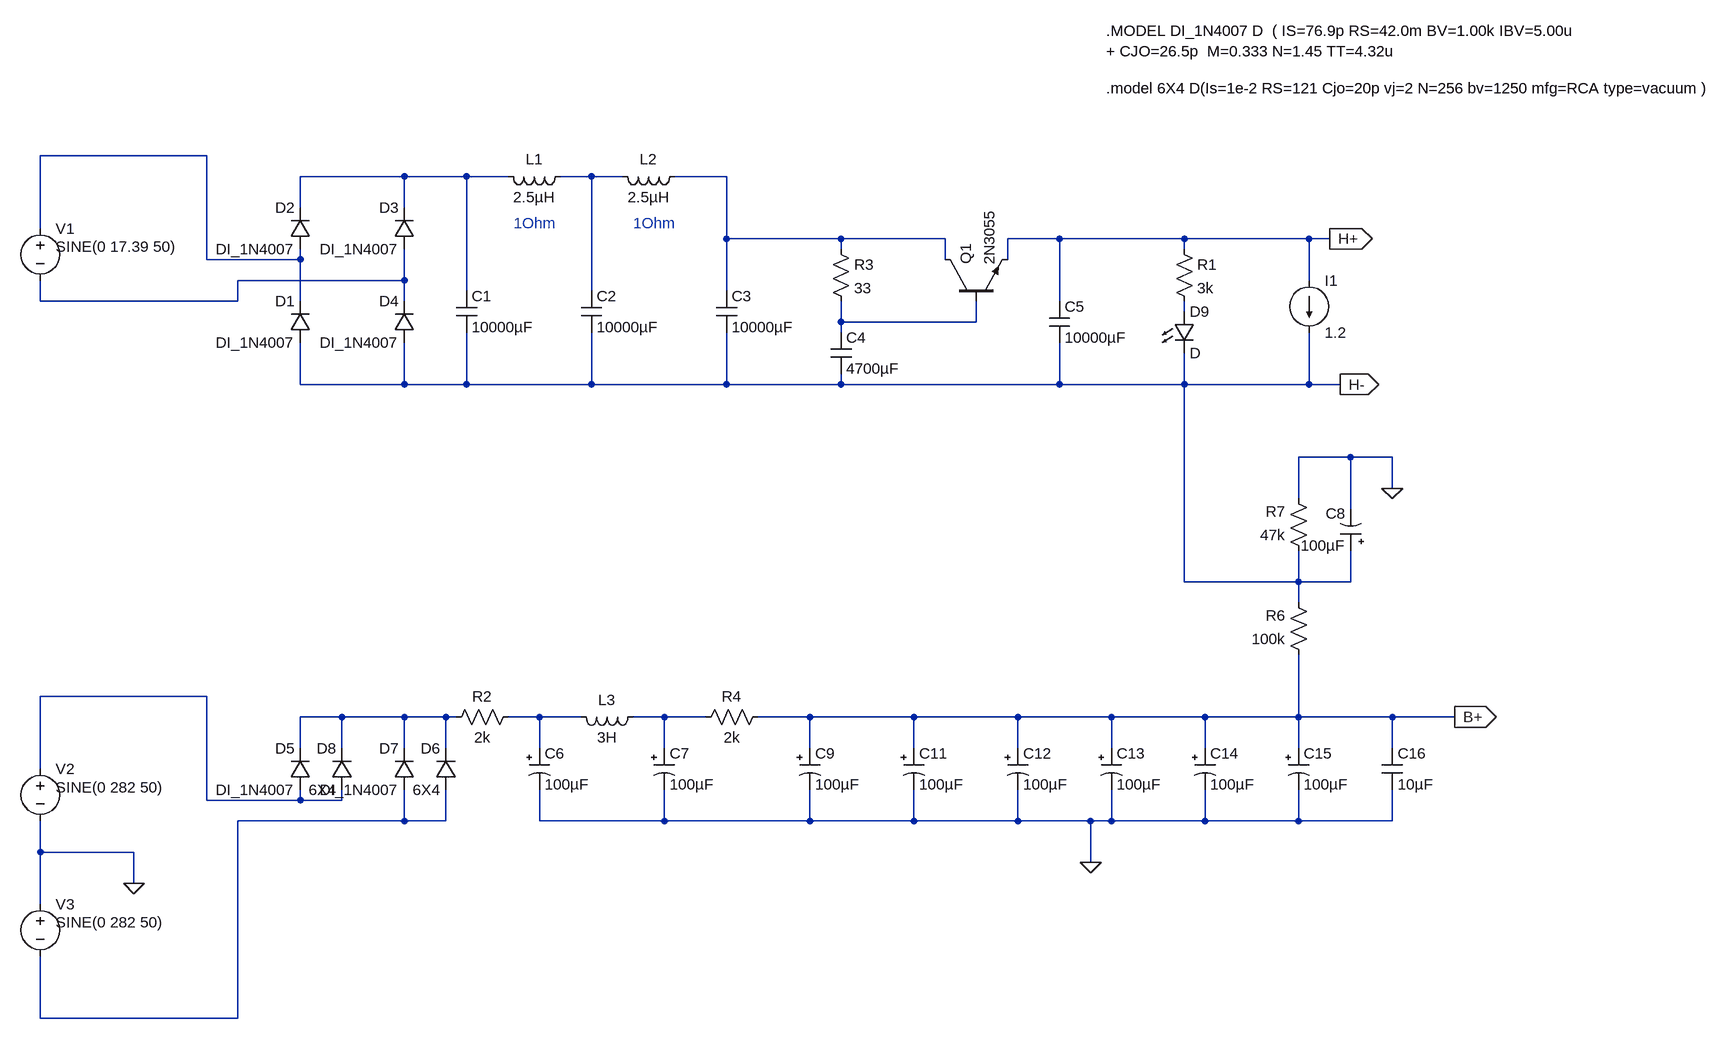
[diagram p0: schematic m77-psu-only.asc]
m77-psu-only.asc, the LTspice schematic file:
Version 4
SHEET 1 2672 1044
WIRE -4304 -5552 -4560 -5552
WIRE -4000 -5520 -4160 -5520
WIRE -3904 -5520 -4000 -5520
WIRE -3840 -5520 -3904 -5520
WIRE -3712 -5520 -3760 -5520
WIRE -3664 -5520 -3712 -5520
WIRE -3504 -5520 -3584 -5520
WIRE -4160 -5472 -4160 -5520
WIRE -4000 -5472 -4000 -5520
WIRE -4560 -5440 -4560 -5552
WIRE -3504 -5424 -3504 -5520
WIRE -3328 -5424 -3504 -5424
WIRE -3168 -5424 -3328 -5424
WIRE -2992 -5424 -3072 -5424
WIRE -2800 -5424 -2992 -5424
WIRE -2608 -5424 -2800 -5424
WIRE -2576 -5424 -2608 -5424
WIRE -3328 -5408 -3328 -5424
WIRE -2800 -5408 -2800 -5424
WIRE -4304 -5392 -4304 -5552
WIRE -4160 -5392 -4160 -5408
WIRE -4160 -5392 -4304 -5392
WIRE -3168 -5392 -3168 -5424
WIRE -3072 -5392 -3072 -5424
WIRE -4000 -5360 -4000 -5408
WIRE -4000 -5360 -4256 -5360
WIRE -2608 -5360 -2608 -5424
WIRE -3904 -5344 -3904 -5520
WIRE -3712 -5344 -3712 -5520
WIRE -3504 -5344 -3504 -5424
WIRE -4560 -5328 -4560 -5360
WIRE -4256 -5328 -4256 -5360
WIRE -4256 -5328 -4560 -5328
WIRE -4160 -5328 -4160 -5392
WIRE -4000 -5328 -4000 -5360
WIRE -2992 -5328 -2992 -5424
WIRE -2800 -5312 -2800 -5328
WIRE -3328 -5296 -3328 -5328
WIRE -3120 -5296 -3120 -5328
WIRE -3120 -5296 -3328 -5296
WIRE -3328 -5280 -3328 -5296
WIRE -4160 -5200 -4160 -5264
WIRE -4000 -5200 -4000 -5264
WIRE -4000 -5200 -4160 -5200
WIRE -3904 -5200 -3904 -5280
WIRE -3904 -5200 -4000 -5200
WIRE -3712 -5200 -3712 -5280
WIRE -3712 -5200 -3904 -5200
WIRE -3504 -5200 -3504 -5280
WIRE -3504 -5200 -3712 -5200
WIRE -3328 -5200 -3328 -5216
WIRE -3328 -5200 -3504 -5200
WIRE -2992 -5200 -2992 -5264
WIRE -2992 -5200 -3328 -5200
WIRE -2800 -5200 -2800 -5248
WIRE -2800 -5200 -2992 -5200
WIRE -2608 -5200 -2608 -5280
WIRE -2608 -5200 -2800 -5200
WIRE -2560 -5200 -2608 -5200
WIRE -2544 -5088 -2624 -5088
WIRE -2480 -5088 -2544 -5088
WIRE -2480 -5040 -2480 -5088
WIRE -2624 -5024 -2624 -5088
WIRE -2544 -5008 -2544 -5088
WIRE -2800 -4896 -2800 -5200
WIRE -2624 -4896 -2624 -4944
WIRE -2624 -4896 -2800 -4896
WIRE -2544 -4896 -2544 -4944
WIRE -2544 -4896 -2624 -4896
WIRE -2624 -4864 -2624 -4896
WIRE -4304 -4720 -4560 -4720
WIRE -4096 -4688 -4160 -4688
WIRE -4000 -4688 -4096 -4688
WIRE -3936 -4688 -4000 -4688
WIRE -3920 -4688 -3936 -4688
WIRE -3792 -4688 -3840 -4688
WIRE -3728 -4688 -3792 -4688
WIRE -3600 -4688 -3648 -4688
WIRE -3536 -4688 -3600 -4688
WIRE -3376 -4688 -3456 -4688
WIRE -3216 -4688 -3376 -4688
WIRE -3056 -4688 -3216 -4688
WIRE -2912 -4688 -3056 -4688
WIRE -2768 -4688 -2912 -4688
WIRE -2624 -4688 -2624 -4784
WIRE -2624 -4688 -2768 -4688
WIRE -2480 -4688 -2624 -4688
WIRE -2384 -4688 -2480 -4688
WIRE -4160 -4640 -4160 -4688
WIRE -4096 -4640 -4096 -4688
WIRE -4000 -4640 -4000 -4688
WIRE -3936 -4640 -3936 -4688
WIRE -3792 -4640 -3792 -4688
WIRE -3600 -4640 -3600 -4688
WIRE -3376 -4640 -3376 -4688
WIRE -3216 -4640 -3216 -4688
WIRE -3056 -4640 -3056 -4688
WIRE -2912 -4640 -2912 -4688
WIRE -2768 -4640 -2768 -4688
WIRE -2624 -4640 -2624 -4688
WIRE -2480 -4640 -2480 -4688
WIRE -4560 -4608 -4560 -4720
WIRE -4304 -4560 -4304 -4720
WIRE -4160 -4560 -4160 -4576
WIRE -4160 -4560 -4304 -4560
WIRE -4096 -4560 -4096 -4576
WIRE -4096 -4560 -4160 -4560
WIRE -4000 -4528 -4000 -4576
WIRE -4000 -4528 -4256 -4528
WIRE -3936 -4528 -3936 -4576
WIRE -3936 -4528 -4000 -4528
WIRE -3792 -4528 -3792 -4576
WIRE -3600 -4528 -3600 -4576
WIRE -3600 -4528 -3792 -4528
WIRE -3376 -4528 -3376 -4576
WIRE -3376 -4528 -3600 -4528
WIRE -3216 -4528 -3216 -4576
WIRE -3216 -4528 -3376 -4528
WIRE -3056 -4528 -3056 -4576
WIRE -3056 -4528 -3216 -4528
WIRE -2944 -4528 -3056 -4528
WIRE -2912 -4528 -2912 -4576
WIRE -2912 -4528 -2944 -4528
WIRE -2768 -4528 -2768 -4576
WIRE -2768 -4528 -2912 -4528
WIRE -2624 -4528 -2624 -4576
WIRE -2624 -4528 -2768 -4528
WIRE -2480 -4528 -2480 -4576
WIRE -2480 -4528 -2624 -4528
WIRE -4560 -4480 -4560 -4528
WIRE -4416 -4480 -4560 -4480
WIRE -2944 -4464 -2944 -4528
WIRE -4416 -4432 -4416 -4480
WIRE -4560 -4400 -4560 -4480
WIRE -4560 -4224 -4560 -4320
WIRE -4256 -4224 -4256 -4528
WIRE -4256 -4224 -4560 -4224
FLAG -2944 -4464 0
FLAG -4416 -4432 0
FLAG -2384 -4688 B+
IOPIN -2384 -4688 Out
FLAG -2576 -5424 H+
IOPIN -2576 -5424 Out
FLAG -2560 -5200 H-
IOPIN -2560 -5200 Out
FLAG -2480 -5040 0
SYMBOL cap -3920 -5344 R0
SYMATTR InstName C1
SYMATTR Value 10000µF
SYMATTR SpiceLine Rser=30mO
SYMBOL ind -3744 -5536 R90
WINDOW 0 5 56 VBottom 2
WINDOW 3 32 56 VTop 2
SYMATTR InstName L1
SYMATTR Value 2.5µH
SYMATTR SpiceLine Rser=1
SYMBOL ind -3568 -5536 R90
WINDOW 0 5 56 VBottom 2
WINDOW 3 32 56 VTop 2
SYMATTR InstName L2
SYMATTR Value 2.5µH
SYMATTR SpiceLine Rser=1
SYMBOL cap -3728 -5344 R0
SYMATTR InstName C2
SYMATTR Value 10000µF
SYMATTR SpiceLine Rser=30mO
SYMBOL cap -3520 -5344 R0
SYMATTR InstName C3
SYMATTR Value 10000µF
SYMATTR SpiceLine Rser=30mO
SYMBOL res -3344 -5424 R0
SYMATTR InstName R3
SYMATTR Value 33
SYMBOL cap -3344 -5280 R0
SYMATTR InstName C4
SYMATTR Value 4700µF
SYMATTR SpiceLine Rser=15m
SYMBOL npn -3168 -5328 R270
SYMATTR InstName Q1
SYMATTR Value 2N3055
SYMBOL cap -3008 -5328 R0
SYMATTR InstName C5
SYMATTR Value 10000µF
SYMATTR SpiceLine Rser=30mO
SYMBOL diode -4144 -5408 R180
WINDOW 0 24 64 Left 2
WINDOW 3 24 0 Left 2
SYMATTR InstName D2
SYMATTR Value DI_1N4007
SYMBOL voltage -4560 -5456 R0
WINDOW 3 24 44 Left 2
WINDOW 39 0 0 Left 0
SYMATTR Value SINE(0 17.39 50)
SYMATTR InstName V1
SYMBOL diode -4144 -5264 R180
WINDOW 0 24 64 Left 2
WINDOW 3 24 0 Left 2
SYMATTR InstName D1
SYMATTR Value DI_1N4007
SYMBOL diode -3984 -5408 R180
WINDOW 0 24 64 Left 2
WINDOW 3 24 0 Left 2
SYMATTR InstName D3
SYMATTR Value DI_1N4007
SYMBOL diode -3984 -5264 R180
WINDOW 0 24 64 Left 2
WINDOW 3 24 0 Left 2
SYMATTR InstName D4
SYMATTR Value DI_1N4007
SYMBOL diode -4144 -4576 R180
WINDOW 0 24 64 Left 2
WINDOW 3 24 0 Left 2
SYMATTR InstName D5
SYMATTR Value DI_1N4007
SYMBOL voltage -4560 -4624 R0
WINDOW 3 24 44 Left 2
WINDOW 39 0 0 Left 0
SYMATTR Value SINE(0 282 50)
SYMATTR InstName V2
SYMBOL diode -3984 -4576 R180
WINDOW 0 24 64 Left 2
WINDOW 3 24 0 Left 2
SYMATTR InstName D7
SYMATTR Value DI_1N4007
SYMBOL LED -2816 -5312 R0
SYMATTR InstName D9
SYMBOL res -2816 -5424 R0
SYMATTR InstName R1
SYMATTR Value 3k
SYMBOL res -3824 -4704 R90
WINDOW 0 0 56 VBottom 2
WINDOW 3 32 56 VTop 2
SYMATTR InstName R2
SYMATTR Value 2k
SYMBOL res -3440 -4704 R90
WINDOW 0 0 56 VBottom 2
WINDOW 3 32 56 VTop 2
SYMATTR InstName R4
SYMATTR Value 2k
SYMBOL res -2608 -4768 R180
WINDOW 0 36 76 Left 2
WINDOW 3 36 40 Left 2
SYMATTR InstName R6
SYMATTR Value 100k
SYMBOL res -2608 -4928 R180
WINDOW 0 36 76 Left 2
WINDOW 3 36 40 Left 2
SYMATTR InstName R7
SYMATTR Value 47k
SYMBOL polcap -2528 -4944 R180
WINDOW 0 24 57 Left 2
WINDOW 3 24 8 Left 2
SYMATTR InstName C8
SYMATTR Value 100µF
SYMBOL voltage -4560 -4416 R0
WINDOW 3 24 44 Left 2
WINDOW 39 0 0 Left 0
SYMATTR Value SINE(0 282 50)
SYMATTR InstName V3
SYMBOL diode -3920 -4576 R180
WINDOW 0 24 64 Left 2
WINDOW 3 24 0 Left 2
SYMATTR InstName D6
SYMATTR Value 6X4
SYMBOL diode -4080 -4576 R180
WINDOW 0 24 64 Left 2
WINDOW 3 24 0 Left 2
SYMATTR InstName D8
SYMATTR Value 6X4
SYMBOL ind -3632 -4704 R90
WINDOW 0 5 56 VBottom 2
WINDOW 3 32 56 VTop 2
SYMATTR InstName L3
SYMATTR Value 3H
SYMATTR SpiceLine Ipk=250 Rser=44
SYMBOL polcap -3808 -4640 R0
SYMATTR InstName C6
SYMATTR Value 100µF
SYMBOL polcap -3616 -4640 R0
SYMATTR InstName C7
SYMATTR Value 100µF
SYMBOL polcap -3392 -4640 R0
SYMATTR InstName C9
SYMATTR Value 100µF
SYMBOL polcap -3232 -4640 R0
SYMATTR InstName C11
SYMATTR Value 100µF
SYMBOL polcap -3072 -4640 R0
SYMATTR InstName C12
SYMATTR Value 100µF
SYMBOL polcap -2928 -4640 R0
SYMATTR InstName C13
SYMATTR Value 100µF
SYMBOL polcap -2784 -4640 R0
SYMATTR InstName C14
SYMATTR Value 100µF
SYMBOL polcap -2640 -4640 R0
SYMATTR InstName C15
SYMATTR Value 100µF
SYMBOL cap -2496 -4640 R0
SYMATTR InstName C16
SYMATTR Value 10µF
SYMBOL load2 -2608 -5360 R0
WINDOW 123 0 0 Left 0
WINDOW 39 0 0 Left 0
SYMATTR InstName I1
SYMATTR Value 1.2
TEXT -2920 -5744 Left 2 !.MODEL DI_1N4007 D  ( IS=76.9p RS=42.0m BV=1.00k IBV=5.00u\n+ CJO=26.5p  M=0.333 N=1.45 TT=4.32u
TEXT -2920 -5656 Left 2 !.model 6X4 D(Is=1e-2 RS=121 Cjo=20p vj=2 N=256 bv=1250 mfg=RCA type=vacuum )
TEXT -3648 -5448 Left 2 ;1Ohm
TEXT -3832 -5448 Left 2 ;1Ohm

The netlist it stands for:
* m77-psu-only.asc
C1 N002 H- 10000µF Rser=30mO
L1 N003 N002 2.5µH Rser=1
L2 N004 N003 2.5µH Rser=1
C2 N003 H- 10000µF Rser=30mO
C3 N004 H- 10000µF Rser=30mO
R3 N004 N007 33
C4 N007 H- 4700µF Rser=15m
Q1 N004 N007 H+ 0 2N3055
C5 H+ H- 10000µF Rser=30mO
D2 N001 N002 DI_1N4007
V1 N001 N005 SINE(0 17.39 50)
D1 H- N001 DI_1N4007
D3 N005 N002 DI_1N4007
D4 H- N005 DI_1N4007
D5 N008 N009 DI_1N4007
V2 N008 0 SINE(0 282 50)
D7 N012 N009 DI_1N4007
D9 N006 H- D
R1 H+ N006 3k
R2 N010 N009 2k
R4 B+ N011 2k
R6 B+ H- 100k
R7 H- 0 47k
C8 H- 0 100µF
V3 0 N012 SINE(0 282 50)
D6 N012 N009 6X4
D8 N008 N009 6X4
L3 N011 N010 3H Ipk=250 Rser=44
C6 N010 0 100µF
C7 N011 0 100µF
C9 B+ 0 100µF
C11 B+ 0 100µF
C12 B+ 0 100µF
C13 B+ 0 100µF
C14 B+ 0 100µF
C15 B+ 0 100µF
C16 B+ 0 10µF
I1 H+ H- 1.2
.model D D
.lib standard.dio
.model NPN NPN
.model PNP PNP
.lib standard.bjt
.MODEL DI_1N4007 D  ( IS=76.9p RS=42.0m BV=1.00k IBV=5.00u
+ CJO=26.5p  M=0.333 N=1.45 TT=4.32u
.model 6X4 D(Is=1e-2 RS=121 Cjo=20p vj=2 N=256 bv=1250 mfg=RCA type=vacuum )
* 1Ohm
* 1Ohm
.backanno
.end